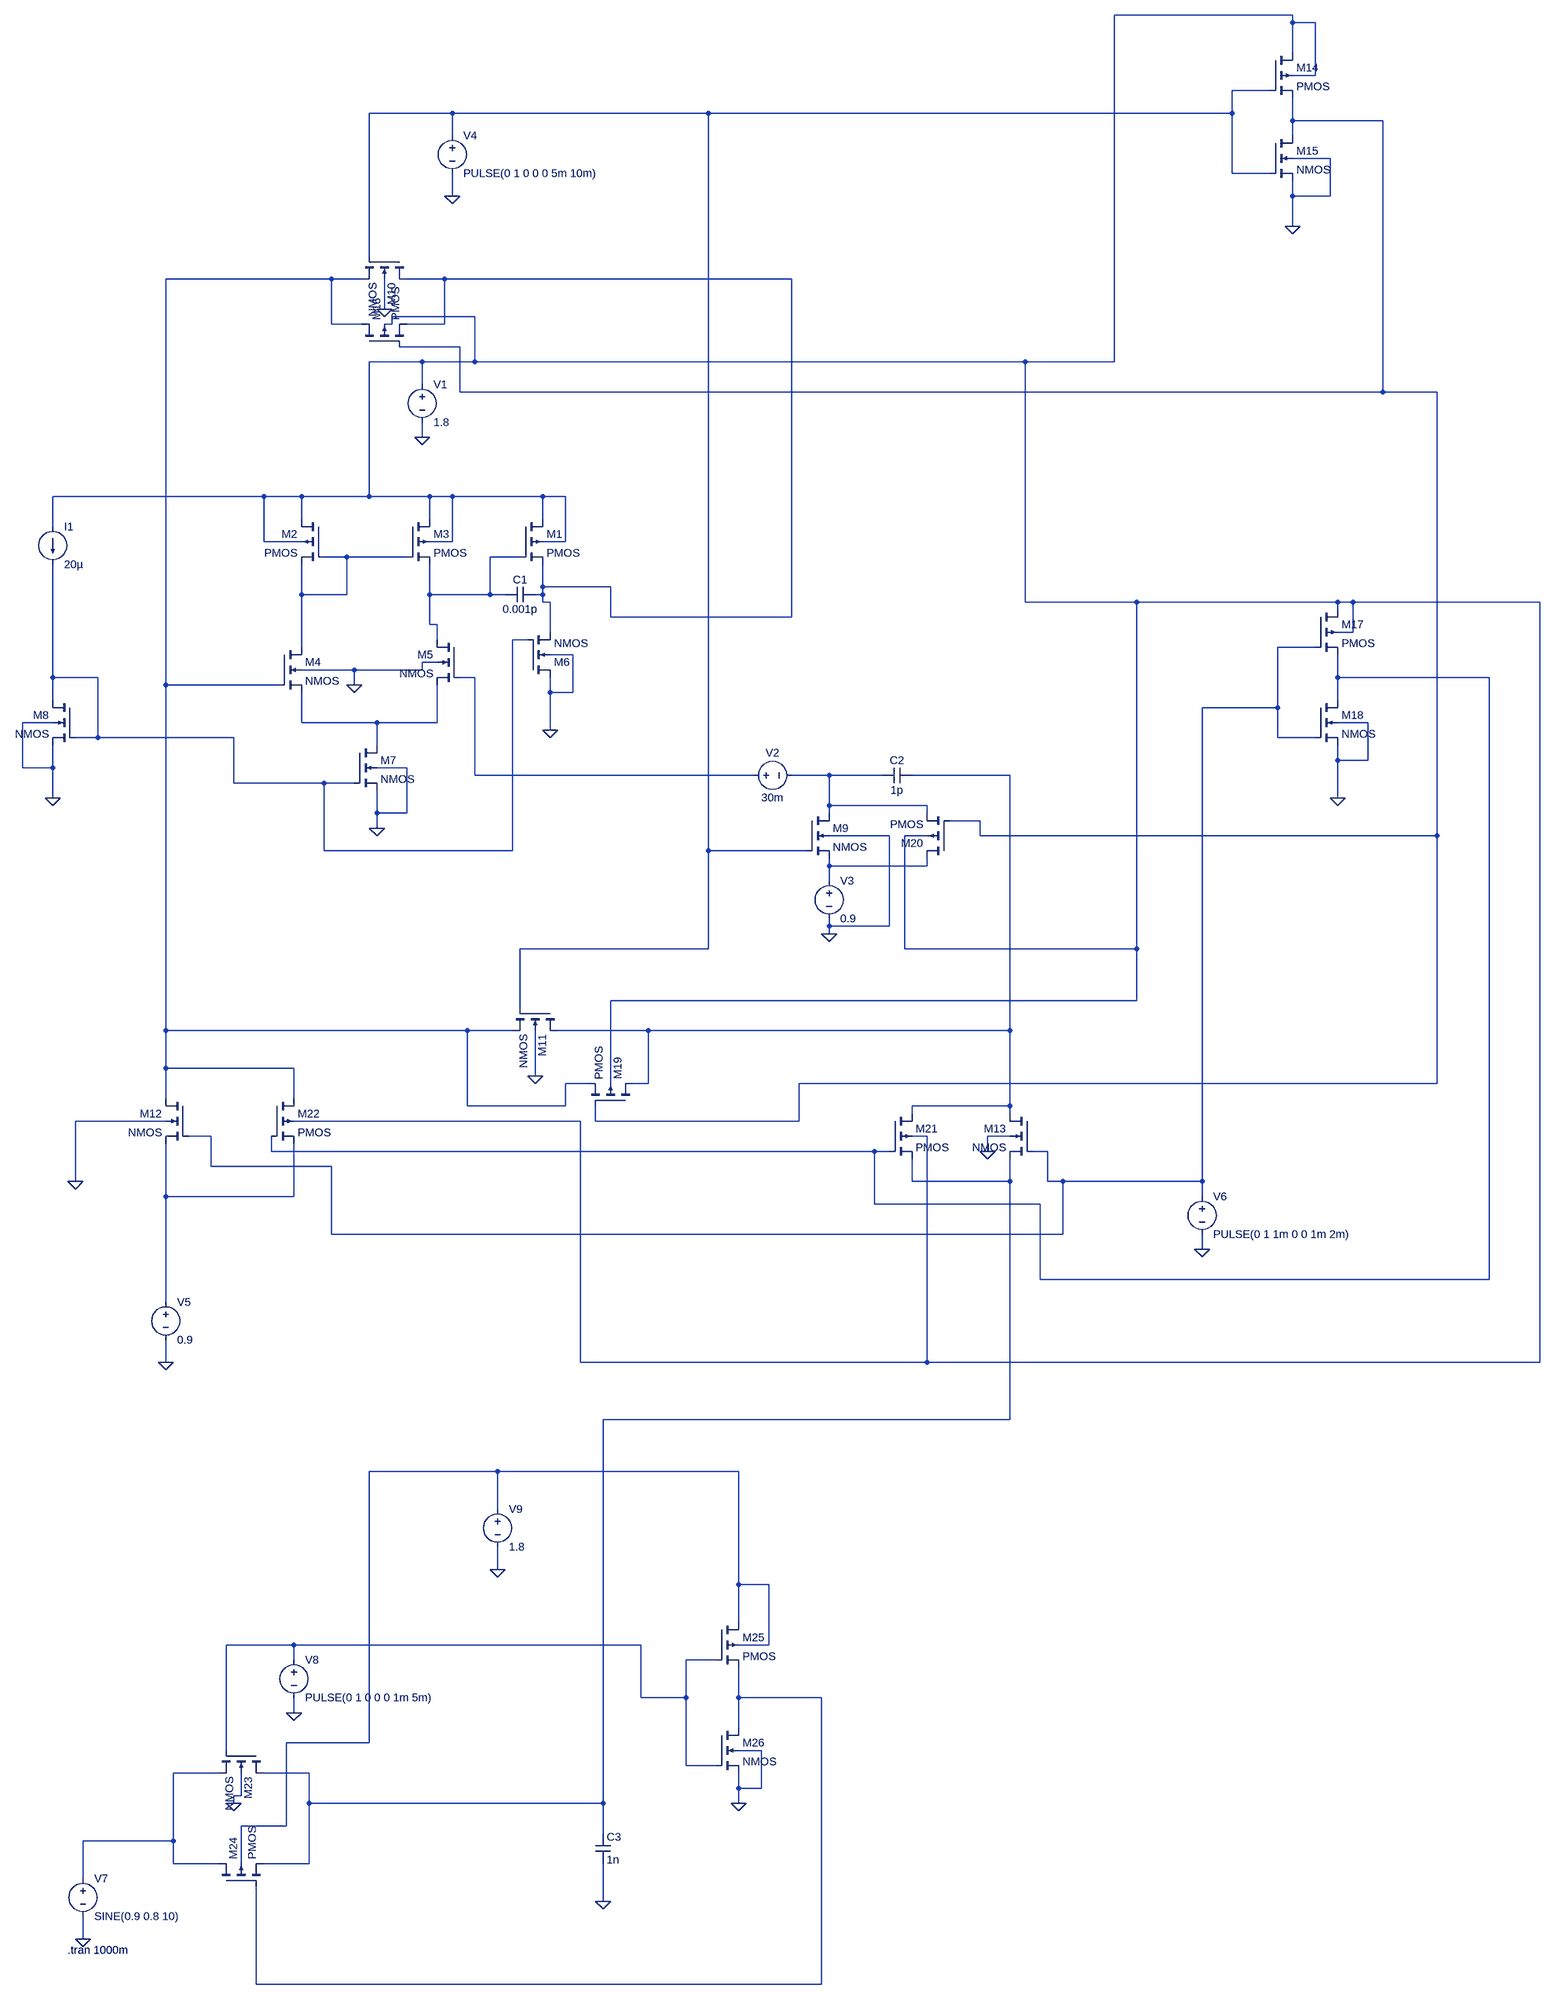
[diagram p0: schematic offset_cancellation_with_input.asc]
offset_cancellation_with_input.asc, the LTspice schematic file:
Version 4
SHEET 1 3028 3348
WIRE 2192 -1040 1680 -1040
WIRE 2192 -1024 2192 -1040
WIRE 2240 -1024 2192 -1024
WIRE 2192 -960 2192 -1024
WIRE 2240 -912 2240 -1024
WIRE 2240 -912 2192 -912
WIRE 2144 -880 2064 -880
WIRE 240 -832 64 -832
WIRE 784 -832 240 -832
WIRE 2064 -832 2064 -880
WIRE 2064 -832 784 -832
WIRE 2192 -816 2192 -864
WIRE 2384 -816 2192 -816
WIRE 240 -784 240 -832
WIRE 2192 -784 2192 -816
WIRE 2272 -736 2192 -736
WIRE 2064 -704 2064 -832
WIRE 2144 -704 2064 -704
WIRE 240 -656 240 -704
WIRE 2192 -656 2192 -688
WIRE 2272 -656 2272 -736
WIRE 2272 -656 2192 -656
WIRE 2192 -592 2192 -656
WIRE 64 -528 64 -832
WIRE -16 -480 -368 -480
WIRE 48 -480 -16 -480
WIRE 224 -480 144 -480
WIRE 960 -480 224 -480
WIRE 96 -416 96 -480
WIRE 288 -400 112 -400
WIRE -16 -384 -16 -480
WIRE 48 -384 -16 -384
WIRE 112 -384 112 -400
WIRE 112 -384 96 -384
WIRE 224 -384 224 -480
WIRE 224 -384 144 -384
WIRE 256 -336 128 -336
WIRE 176 -304 64 -304
WIRE 288 -304 288 -400
WIRE 288 -304 176 -304
WIRE 1456 -304 288 -304
WIRE 1680 -304 1680 -1040
WIRE 1680 -304 1456 -304
WIRE 176 -256 176 -304
WIRE 256 -240 256 -336
WIRE 2384 -240 2384 -816
WIRE 2384 -240 256 -240
WIRE 2560 -240 2384 -240
WIRE 176 -144 176 -176
WIRE -160 0 -608 0
WIRE -80 0 -160 0
WIRE 64 0 64 -304
WIRE 64 0 -80 0
WIRE 192 0 64 0
WIRE 240 0 192 0
WIRE 432 0 240 0
WIRE 480 0 432 0
WIRE -80 48 -80 0
WIRE 192 48 192 0
WIRE 432 48 432 0
WIRE -608 64 -608 0
WIRE -160 96 -160 0
WIRE -80 96 -160 96
WIRE 240 96 240 0
WIRE 240 96 192 96
WIRE 480 96 480 0
WIRE 480 96 432 96
WIRE 16 128 -32 128
WIRE 144 128 16 128
WIRE 384 128 320 128
WIRE 432 192 432 144
WIRE 576 192 432 192
WIRE -80 208 -80 144
WIRE 16 208 16 128
WIRE 16 208 -80 208
WIRE 192 208 192 144
WIRE 320 208 320 128
WIRE 320 208 192 208
WIRE 352 208 320 208
WIRE 432 208 432 192
WIRE 432 208 416 208
WIRE 432 224 432 208
WIRE 448 224 432 224
WIRE 1456 224 1456 -304
WIRE 1728 224 1456 224
WIRE 2288 224 1728 224
WIRE 2320 224 2288 224
WIRE 3024 224 2320 224
WIRE 2288 240 2288 224
WIRE 576 256 576 192
WIRE 960 256 960 -480
WIRE 960 256 576 256
WIRE 192 272 192 208
WIRE 208 272 192 272
WIRE 448 288 448 224
WIRE 2320 288 2320 224
WIRE 2320 288 2288 288
WIRE 208 304 208 272
WIRE 400 304 368 304
WIRE -80 320 -80 208
WIRE 2240 320 2160 320
WIRE 496 336 448 336
WIRE 208 352 176 352
WIRE 32 368 -80 368
WIRE 176 368 176 352
WIRE 176 368 32 368
WIRE -608 384 -608 144
WIRE -512 384 -608 384
WIRE 288 384 256 384
WIRE 2288 384 2288 336
WIRE 2736 384 2288 384
WIRE -368 400 -368 -480
WIRE -128 400 -368 400
WIRE 32 400 32 368
WIRE 448 416 448 384
WIRE 496 416 496 336
WIRE 496 416 448 416
WIRE -608 432 -608 384
WIRE 2288 432 2288 384
WIRE 2160 448 2160 320
WIRE 2160 448 2000 448
WIRE -608 480 -672 480
WIRE -80 480 -80 416
WIRE 80 480 -80 480
WIRE 208 480 208 400
WIRE 208 480 80 480
WIRE 2352 480 2288 480
WIRE 448 496 448 416
WIRE -512 512 -512 384
WIRE -512 512 -560 512
WIRE -224 512 -512 512
WIRE 2160 512 2160 448
WIRE 2240 512 2160 512
WIRE 80 528 80 480
WIRE 2288 560 2288 528
WIRE 2352 560 2352 480
WIRE 2352 560 2288 560
WIRE -672 576 -672 480
WIRE -608 576 -608 528
WIRE -608 576 -672 576
WIRE 144 576 80 576
WIRE 288 592 288 384
WIRE 880 592 288 592
WIRE 1040 592 960 592
WIRE 1152 592 1040 592
WIRE 1424 592 1216 592
WIRE -224 608 -224 512
WIRE -32 608 -224 608
WIRE 32 608 -32 608
WIRE -608 640 -608 576
WIRE 2288 640 2288 560
WIRE 1040 656 1040 592
WIRE 1248 656 1040 656
WIRE 80 672 80 624
WIRE 144 672 144 576
WIRE 144 672 80 672
WIRE 1040 672 1040 656
WIRE 1248 672 1248 656
WIRE 1360 688 1296 688
WIRE 80 704 80 672
WIRE 1168 720 1040 720
WIRE 1248 720 1200 720
WIRE 1360 720 1360 688
WIRE 2560 720 2560 -240
WIRE 2560 720 1360 720
WIRE -32 752 -32 608
WIRE 368 752 368 304
WIRE 368 752 -32 752
WIRE 784 752 784 -832
WIRE 992 752 784 752
WIRE 1040 784 1040 768
WIRE 1248 784 1248 768
WIRE 1248 784 1040 784
WIRE 1040 816 1040 784
WIRE 1040 912 1040 896
WIRE 1168 912 1168 720
WIRE 1168 912 1040 912
WIRE 1040 928 1040 912
WIRE 784 960 784 752
WIRE 784 960 384 960
WIRE 1200 960 1200 720
WIRE 1728 960 1728 224
WIRE 1728 960 1200 960
WIRE 1728 1088 1728 960
WIRE 1728 1088 576 1088
WIRE 384 1104 384 960
WIRE -368 1152 -368 400
WIRE 272 1152 -368 1152
WIRE 368 1152 272 1152
WIRE 656 1152 464 1152
WIRE 1424 1152 1424 592
WIRE 1424 1152 656 1152
WIRE -368 1232 -368 1152
WIRE -96 1232 -368 1232
WIRE 416 1248 416 1152
WIRE 528 1264 480 1264
WIRE 576 1264 576 1088
WIRE 656 1264 656 1152
WIRE 656 1264 624 1264
WIRE 2560 1264 2560 720
WIRE 2560 1264 976 1264
WIRE -368 1296 -368 1232
WIRE -96 1296 -96 1232
WIRE 272 1312 272 1152
WIRE 480 1312 480 1264
WIRE 480 1312 272 1312
WIRE 1424 1312 1424 1152
WIRE 1424 1312 1216 1312
WIRE 1216 1328 1216 1312
WIRE 1424 1328 1424 1312
WIRE -368 1344 -560 1344
WIRE 512 1344 -96 1344
WIRE 544 1344 544 1312
WIRE 976 1344 976 1264
WIRE 976 1344 544 1344
WIRE -272 1376 -320 1376
WIRE 1248 1376 1216 1376
WIRE 1424 1376 1376 1376
WIRE -144 1408 -144 1376
WIRE 1136 1408 -144 1408
WIRE 1168 1408 1136 1408
WIRE 1376 1408 1376 1376
WIRE 1504 1408 1472 1408
WIRE -272 1440 -272 1376
WIRE -16 1440 -272 1440
WIRE -560 1472 -560 1344
WIRE 1216 1472 1216 1424
WIRE 1424 1472 1424 1424
WIRE 1424 1472 1216 1472
WIRE 1504 1472 1504 1408
WIRE 1536 1472 1504 1472
WIRE 2000 1472 2000 448
WIRE 2000 1472 1536 1472
WIRE -368 1504 -368 1392
WIRE -96 1504 -96 1392
WIRE -96 1504 -368 1504
WIRE 2000 1504 2000 1472
WIRE 1136 1520 1136 1408
WIRE 1488 1520 1136 1520
WIRE -16 1584 -16 1440
WIRE 1536 1584 1536 1472
WIRE 1536 1584 -16 1584
WIRE 2000 1616 2000 1584
WIRE 1488 1680 1488 1520
WIRE 2736 1680 2736 384
WIRE 2736 1680 1488 1680
WIRE -368 1728 -368 1504
WIRE -368 1856 -368 1808
WIRE 512 1856 512 1344
WIRE 1248 1856 1248 1376
WIRE 1248 1856 512 1856
WIRE 3024 1856 3024 224
WIRE 3024 1856 1248 1856
WIRE 1424 2064 1424 1472
WIRE 1424 2064 560 2064
WIRE 336 2256 64 2256
WIRE 848 2256 336 2256
WIRE 336 2336 336 2256
WIRE 336 2464 336 2416
WIRE 848 2496 848 2256
WIRE 912 2496 848 2496
WIRE 848 2576 848 2496
WIRE -96 2624 -240 2624
WIRE 640 2624 -96 2624
WIRE 912 2624 912 2496
WIRE 912 2624 848 2624
WIRE -96 2656 -96 2624
WIRE 800 2656 736 2656
WIRE 640 2736 640 2624
WIRE 736 2736 736 2656
WIRE 736 2736 640 2736
WIRE 848 2736 848 2672
WIRE 1024 2736 848 2736
WIRE -96 2768 -96 2736
WIRE 848 2800 848 2736
WIRE 64 2832 64 2256
WIRE 64 2832 -112 2832
WIRE -240 2848 -240 2624
WIRE 896 2848 848 2848
WIRE 736 2880 736 2736
WIRE 800 2880 736 2880
WIRE -256 2896 -352 2896
WIRE -64 2896 -160 2896
WIRE 848 2928 848 2896
WIRE 896 2928 896 2848
WIRE 896 2928 848 2928
WIRE -208 2944 -208 2896
WIRE -208 2944 -224 2944
WIRE -224 2960 -224 2944
WIRE -64 2960 -64 2896
WIRE 560 2960 560 2064
WIRE 560 2960 -64 2960
WIRE 848 2960 848 2928
WIRE -112 3008 -112 2832
WIRE -112 3008 -208 3008
WIRE 560 3024 560 2960
WIRE -352 3040 -352 2896
WIRE -352 3040 -544 3040
WIRE -352 3088 -352 3040
WIRE -256 3088 -352 3088
WIRE -208 3088 -208 3008
WIRE -64 3088 -64 2960
WIRE -64 3088 -160 3088
WIRE -544 3120 -544 3040
WIRE 560 3168 560 3088
WIRE -544 3248 -544 3200
WIRE -176 3344 -176 3136
WIRE 1024 3344 1024 2736
WIRE 1024 3344 -176 3344
FLAG 80 704 0
FLAG 448 496 0
FLAG -608 640 0
FLAG 176 -144 0
FLAG 1040 928 0
FLAG 96 -416 0
FLAG 240 -656 0
FLAG 416 1248 0
FLAG -368 1856 0
FLAG -560 1472 0
FLAG 2000 1616 0
FLAG 2192 -592 0
FLAG 2288 640 0
FLAG 1376 1408 0
FLAG -544 3248 0
FLAG -96 2768 0
FLAG 336 2464 0
FLAG 560 3168 0
FLAG -224 2960 0
FLAG 848 2960 0
FLAG 32 400 0
SYMBOL pmos4 384 48 R0
SYMATTR InstName M1
SYMATTR Value2 l=1u w=10u
SYMBOL pmos4 -32 48 M0
SYMATTR InstName M2
SYMATTR Value2 l=1u w=10u
SYMBOL pmos4 144 48 R0
SYMATTR InstName M3
SYMATTR Value2 l=1u w=10u
SYMBOL nmos4 -128 320 R0
SYMATTR InstName M4
SYMATTR Value2 l=2u w=20u
SYMBOL nmos4 256 304 M0
SYMATTR InstName M5
SYMATTR Value2 l=2u w=20u
SYMBOL nmos4 400 384 M180
SYMATTR InstName M6
SYMATTR Value2 l=5u w=10u
SYMBOL nmos4 32 528 R0
SYMATTR InstName M7
SYMATTR Value2 l=5u w=10u
SYMBOL cap 416 192 R90
WINDOW 0 0 32 VBottom 2
WINDOW 3 32 32 VTop 2
SYMATTR InstName C1
SYMATTR Value 0.001p
SYMBOL current -608 64 R0
WINDOW 123 0 0 Left 2
WINDOW 39 0 0 Left 2
SYMATTR InstName I1
SYMATTR Value 20µ
SYMBOL nmos4 -560 432 M0
SYMATTR InstName M8
SYMATTR Value2 l=5u w=10u
SYMBOL voltage 176 -272 R0
WINDOW 123 0 0 Left 2
WINDOW 39 0 0 Left 2
SYMATTR InstName V1
SYMATTR Value 1.8
SYMBOL voltage 864 592 R270
WINDOW 0 32 56 VTop 2
WINDOW 3 -32 56 VBottom 2
WINDOW 123 0 0 Left 2
WINDOW 39 0 0 Left 2
SYMATTR InstName V2
SYMATTR Value 30m
SYMBOL cap 1216 576 R90
WINDOW 0 0 32 VBottom 2
WINDOW 3 32 32 VTop 2
SYMATTR InstName C2
SYMATTR Value 1p
SYMBOL voltage 1040 800 R0
WINDOW 123 0 0 Left 2
WINDOW 39 0 0 Left 2
SYMATTR InstName V3
SYMATTR Value 0.9
SYMBOL nmos4 992 672 R0
SYMATTR InstName M9
SYMATTR Value2 l=1u w=10u
SYMBOL nmos4 144 -528 R90
SYMATTR InstName M10
SYMATTR Value2 l=1u w=10u
SYMBOL voltage 240 -800 R0
WINDOW 123 0 0 Left 2
WINDOW 39 0 0 Left 2
SYMATTR InstName V4
SYMATTR Value PULSE(0 1 0 0 0 5m 10m)
SYMBOL nmos4 464 1104 R90
SYMATTR InstName M11
SYMATTR Value2 l=1u w=10u
SYMBOL voltage -368 1712 R0
WINDOW 123 0 0 Left 2
WINDOW 39 0 0 Left 2
SYMATTR InstName V5
SYMATTR Value 0.9
SYMBOL nmos4 -320 1296 M0
SYMATTR InstName M12
SYMATTR Value2 l=1u w=10u
SYMBOL voltage 2000 1488 R0
WINDOW 123 0 0 Left 2
WINDOW 39 0 0 Left 2
SYMATTR InstName V6
SYMATTR Value PULSE(0 1 1m 0 0 1m 2m)
SYMBOL pmos4 2144 -960 R0
SYMATTR InstName M14
SYMATTR Value2 l=1u w=10u
SYMBOL nmos4 2144 -784 R0
SYMATTR InstName M15
SYMATTR Value2 l=1u w=10u
SYMBOL pmos4 48 -336 R270
SYMATTR InstName M16
SYMATTR Value2 l=1u w=10u
SYMBOL pmos4 2240 240 R0
SYMATTR InstName M17
SYMATTR Value2 l=1u w=10u
SYMBOL nmos4 2240 432 R0
SYMATTR InstName M18
SYMATTR Value2 l=1u w=10u
SYMBOL pmos4 624 1312 M270
SYMATTR InstName M19
SYMBOL pmos4 1296 768 R180
SYMATTR InstName M20
SYMATTR Value2 l=1u w=10u
SYMBOL pmos4 1168 1328 R0
SYMATTR InstName M21
SYMATTR Value2 l=1u w=10u
SYMBOL pmos4 -144 1296 R0
SYMATTR InstName M22
SYMATTR Value2 l=1u w=10u
SYMBOL nmos4 1472 1328 M0
SYMATTR InstName M13
SYMBOL voltage -544 3104 R0
WINDOW 123 24 124 Left 2
WINDOW 39 0 0 Left 2
SYMATTR InstName V7
SYMATTR Value SINE(0.9 0.8 10)
SYMBOL voltage -96 2640 R0
WINDOW 123 0 0 Left 2
WINDOW 39 0 0 Left 2
SYMATTR InstName V8
SYMATTR Value PULSE(0 1 0 0 0 1m 5m)
SYMBOL voltage 336 2320 R0
WINDOW 123 0 0 Left 2
WINDOW 39 0 0 Left 2
SYMATTR InstName V9
SYMATTR Value 1.8
SYMBOL cap 544 3024 R0
SYMATTR InstName C3
SYMATTR Value 1n
SYMBOL nmos4 -160 2848 R90
SYMATTR InstName M23
SYMATTR Value2 l=2u w=20u
SYMBOL pmos4 -256 3136 R270
SYMATTR InstName M24
SYMATTR Value2 l=2u w=20u
SYMBOL pmos4 800 2576 R0
SYMATTR InstName M25
SYMATTR Value2 l=2u w=10u
SYMBOL nmos4 800 2800 R0
SYMATTR InstName M26
SYMATTR Value2 l=2u w=10u
TEXT -576 3272 Left 2 !.tran 1000m

The netlist it stands for:
* offset_cancellation_with_input.asc
M1 N001 N007 N005 N001 PMOS l=1u w=10u
M2 N001 N006 N006 N001 PMOS l=1u w=10u
M3 N001 N006 N007 N001 PMOS l=1u w=10u
M4 N006 N004 N012 0 NMOS l=2u w=20u
M5 N007 N010 N012 0 NMOS l=2u w=20u
M6 0 N008 N005 0 NMOS l=5u w=10u
M7 N012 N008 0 0 NMOS l=5u w=10u
C1 N005 N007 0.001p
I1 N001 N008 20µ
M8 N008 N008 0 0 NMOS l=5u w=10u
V1 N001 0 1.8
V2 N010 N013 30m
C2 N014 N013 1p
V3 N015 0 0.9
M9 N013 N002 N015 0 NMOS l=1u w=10u
M10 N005 N002 N004 0 NMOS l=1u w=10u
V4 N002 0 PULSE(0 1 0 0 0 5m 10m)
M11 N014 N002 N004 0 NMOS l=1u w=10u
V5 N017 0 0.9
M12 N004 N009 N017 0 NMOS l=1u w=10u
V6 N009 0 PULSE(0 1 1m 0 0 1m 2m)
M14 N001 N002 N003 N001 PMOS l=1u w=10u
M15 N003 N002 0 0 NMOS l=1u w=10u
M16 N004 N003 N005 N001 PMOS l=1u w=10u
M17 N001 N009 N011 N001 PMOS l=1u w=10u
M18 N011 N009 0 0 NMOS l=1u w=10u
M19 N014 N003 N004 N001 PMOS
M20 N015 N003 N013 N001 PMOS l=1u w=10u
M21 N014 N011 N016 N001 PMOS l=1u w=10u
M22 N004 N011 N017 N001 PMOS l=1u w=10u
M13 N014 N009 N016 0 NMOS
V7 N021 0 SINE(0.9 0.8 10)
V8 N019 0 PULSE(0 1 0 0 0 1m 5m)
V9 N018 0 1.8
C3 N016 0 1n
M23 N016 N019 N021 0 NMOS l=2u w=20u
M24 N021 N020 N016 N018 PMOS l=2u w=20u
M25 N018 N019 N020 N018 PMOS l=2u w=10u
M26 N020 N019 0 0 NMOS l=2u w=10u
.model NMOS NMOS
.model PMOS PMOS
.lib standard.mos
.tran 1000m
.backanno
.end